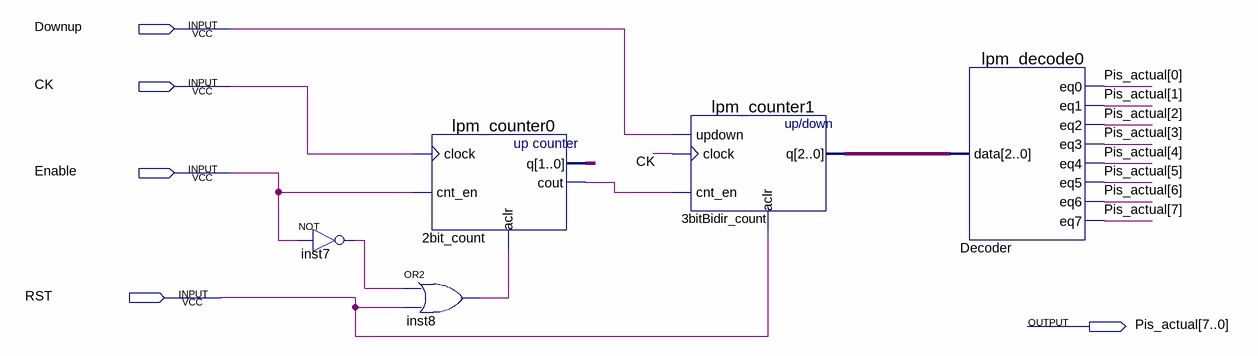
[diagram p0: schematic sheet]
// Quartus schematic Pis.bdf as structural Verilog: 5 symbols, 5 pins
module Pis (
  input  Downup,
  input  CK,
  input  Enable,
  input  RST,
  output [7:0] Pis_actual
);

  wire inst7_out, inst8_out, n2bit_count_cout;
  wire [1:0] n2bit_count_q;
  wire [2:0] n3bitBidir_count_q;

  not inst7 (inst7_out, Enable);
  lpm_counter0 u_2bit_count (.clock(CK), .cnt_en(Enable), .aclr(inst8_out), .q(n2bit_count_q), .cout(n2bit_count_cout));
  or inst8 (inst8_out, inst7_out, RST);
  lpm_counter1 u_3bitBidir_count (
    .updown(Downup), .clock(CK), .cnt_en(n2bit_count_cout), .aclr(RST), .q(n3bitBidir_count_q));
  lpm_decode0 Decoder (
    .data(n3bitBidir_count_q), .eq0(Pis_actual[0]), .eq1(Pis_actual[1]), .eq2(Pis_actual[2]),
    .eq3(Pis_actual[3]), .eq4(Pis_actual[4]), .eq5(Pis_actual[5]), .eq6(Pis_actual[6]), .eq7(Pis_actual[7]));
endmodule
